# Altium schematic sheet Power.SchDoc: POWER
size A4; ApprovedBy: ANBI; CheckedBy: ANBI; Author: SEOKIPO; CompanyName: SY 동아퓨얼셀; DrawnBy: SEOKIPO; Engineer: SEOKIPO; Revision: 001; SheetNumber: 6; SheetTotal: 6
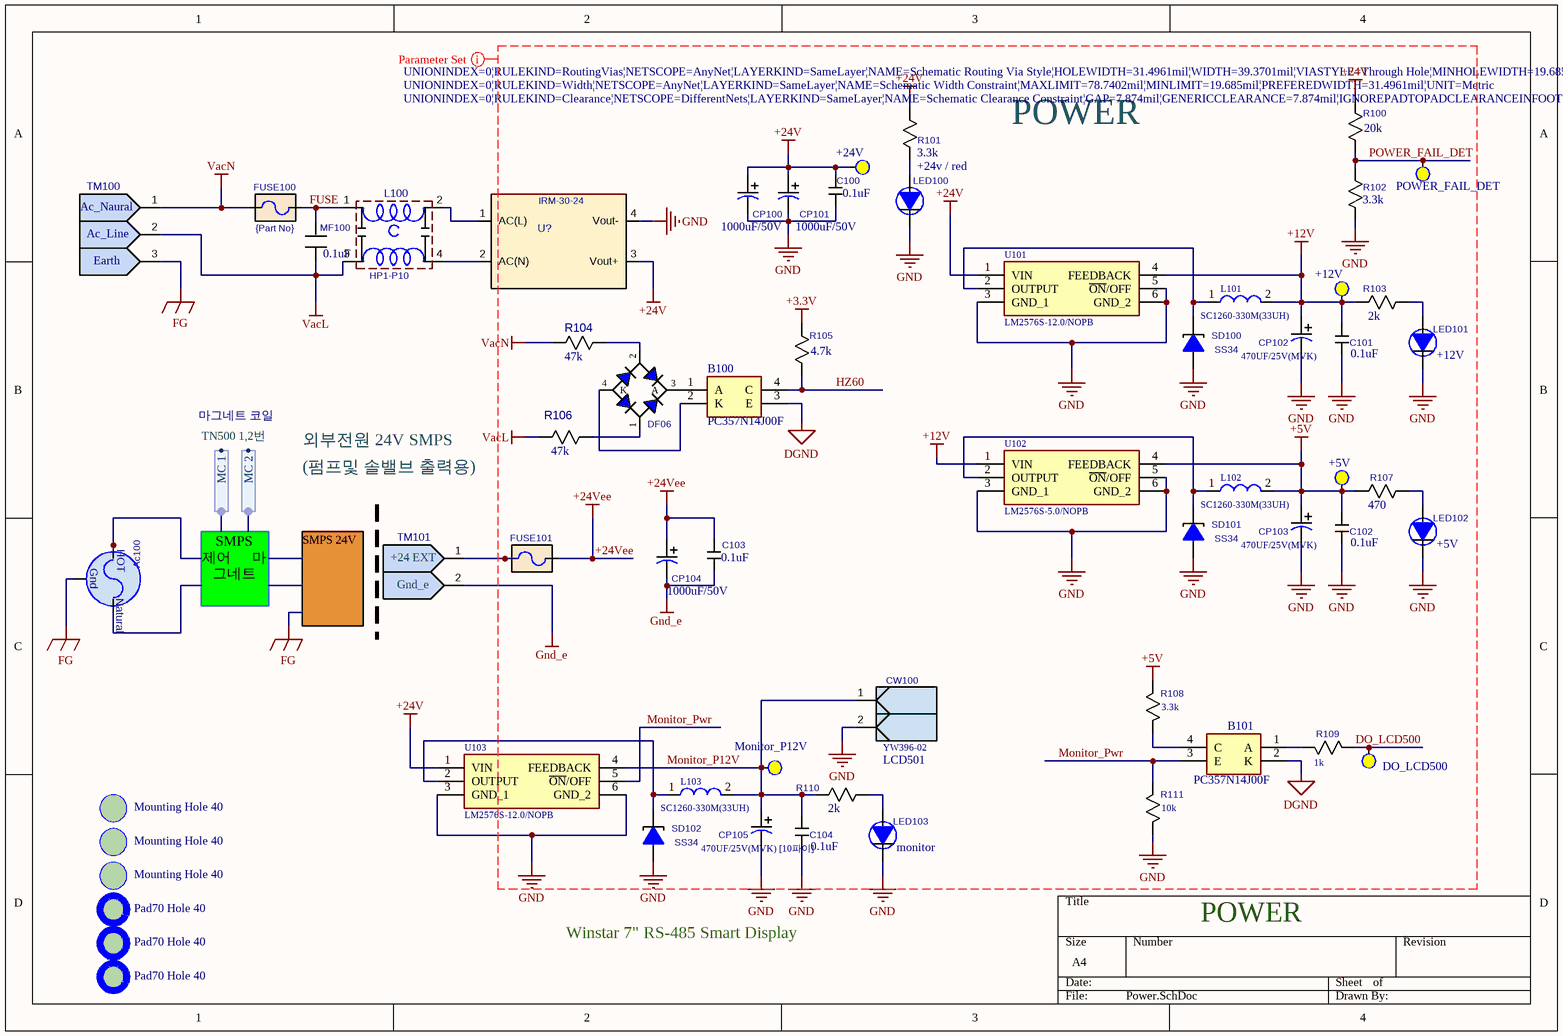
[diagram p0: Power.SchDoc]

## Parts
+5V  Test Point_top  [TP_KEYSTONE_5000]  (value not drawn)
+12V  Test Point_top  [TP_KEYSTONE_5000]  (value not drawn)
+24V  Test Point_top  [TP_KEYSTONE_5000]  (value not drawn)
Ac100  ac2  (value not drawn)
B100  PC357N14J00F  [SOP254P675X300-4N]
B101  PC357N14J00F  [SOP254P675X300-4N]
BD100  Part No.: DF06  [DF-S]  (hidden comment: DF06S)
C100  규격: 0.1uF  [CC2012]  (hidden comment: CS2012)
C101  규격: 0.1uF  [CC2012]  (hidden comment: CS2012)
C102  규격: 0.1uF  [CC2012]  (hidden comment: CS2012)
C103  규격: 0.1uF  [CC2012]  (hidden comment: CS2012)
C104  규격: 0.1uF  [CC2012]  (hidden comment: CS2012)
CP100  규격: 1000uF/50V  [CP5_12]  (hidden comment: CP5_12)
CP101  규격: 1000uF/50V  [CP5_12]  (hidden comment: CP5_12)
CP102  규격: 470UF/25V(MVK)  [CP10_SMT]  (hidden comment: CP10_SMT)
CP103  규격: 470UF/25V(MVK)  [CP10_SMT]  (hidden comment: CP10_SMT)
CP104  규격: 1000uF/50V  [CP5_12]  (hidden comment: CP5_12)
CP105  규격: 470UF/25V(MVK) [10파이]  [CP10_SMT]  (hidden comment: CP10_SMT)
CW100  BOP No.: LCD501  [YW396_02]  (hidden comment: YW396-02)
DO_LCD500  Test Point_top  [TP_KEYSTONE_5000]  (value not drawn)
FUSE100  Part No.: {Part No}  [FUSE_HOLD_S]  (hidden comment: FUSE_CASE)
FUSE101  FUSE_CASE  [FUSE_HOLD_S]  (value not drawn)
Hole100  Mounting Hole 40  [HOLE40]
Hole101  Mounting Hole 40  [HOLE40]
Hole103  Mounting Hole 40  [HOLE40]
Hole104  Pad70 Hole 40  [pad70h45]
Hole105  Pad70 Hole 40  [pad70h45]
Hole?  Pad70 Hole 40  [pad70h45]
L100  Part No.: HP1-P10  [NF_HP1]  (hidden comment: NF_HP1)
L101  Part No.: SC1260-330M(33UH)  [SC1260S]  (hidden comment: SC1260)
L102  Part No.: SC1260-330M(33UH)  [SC1260S]  (hidden comment: SC1260)
L103  Part No.: SC1260-330M(33UH)  [SC1260S]  (hidden comment: SC1260)
LED100  Name: +24v / red  [LED1608]  (hidden comment: LED1608)
LED101  Name: +12V  [LED1608]  (hidden comment: LED1608)
LED102  Name: +5V  [LED1608]  (hidden comment: LED1608)
LED103  Name: monitor  [LED1608]  (hidden comment: LED1608)
MF100  규격: 0.1uF  [MF_104_Filkor]  (hidden comment: MF104_FLIKO)
Monitor_P12V  Test Point_top  [TP_KEYSTONE_5000]  (value not drawn)
POWER_FAIL_DET  Test Point_top  [TP_KEYSTONE_5000]  (value not drawn)
R100  규격: 20k  [RESC1608X55N]  (hidden comment: R1608)
R101  규격: 3.3k  [RESC1608X55N]  (hidden comment: R1608)
R102  규격: 3.3k  [RESC1608X55N]  (hidden comment: R1608)
R103  규격: 2k  [RESC1608X55N]  (hidden comment: R1608)
R104  규격: 47k  [R3216]  (hidden comment: R3216)
R105  규격: 4.7k  [RESC1608X55N]  (hidden comment: R1608)
R106  규격: 47k  [R3216]  (hidden comment: R3216)
R107  규격: 470  [RESC1608X55N]  (hidden comment: R1608)
R108  규격: 3.3k  [RESC1608X55N]  (hidden comment: R1608)
R109  규격: 1k  [RESC1608X55N]  (hidden comment: R1608)
R110  규격: 2k  [RESC1608X55N]  (hidden comment: R1608)
R111  규격: 10k  [RESC1608X55N]  (hidden comment: R1608)
SD100  Part No.: SS34  [D5025]  (hidden comment: SK_SMT)
SD101  Part No.: SS34  [D5025]  (hidden comment: SK_SMT)
SD102  Part No.: SS34  [D5025]  (hidden comment: SK_SMT)
TM100  TERMINAL-2PIN  [TERMINAL_10_3]  (value not drawn)
TM101  TERMINAL-2PIN  [TERMINAL_10_2]  (value not drawn)
U101  Part No.: LM2576S-12.0/NOPB  [KTT0005B]  (hidden comment: LM2576S-5.0_NOPB)
U102  Part No.: LM2576S-5.0/NOPB  [KTT0005B]  (hidden comment: LM2576S-5.0_NOPB)
U103  Part No.: LM2576S-12.0/NOPB  [KTT0005B]  (hidden comment: SC1260-330M(33UH))
U?  AC2DC 24V_1200mA  (value not drawn)

## Harnesses
마그네트 코일: MC 1
?: MC 2

## Nets
+3.3V: R105.1
+5V: +5V.1(tp) C102.2 CP103.2 L102.2 R107.1 R108.2 U102.4(FEEDBACK)
+12V: +12V.1(tp) C101.2 CP102.2 L101.2 R103.1 U101.4(FEEDBACK) U102.1(VIN)
+24V: +24V.1(tp) C100.2 CP100.2 CP101.2 R100.1 R101.1 U101.1(VIN) U103.1(VIN) U?.3(Vout+)
+24Vee: C103.2 CP104.2 FUSE101.2
DGND: B100.3(E) B101.2(K)
FG: Ac100.3(GND) TM100.3
GND: C100.1 C101.1 C102.1 C104.1 CP100.1 CP101.1 CP102.1 CP103.1 CP105.1 CW100.2 LED100.2 LED101.2 LED102.2 LED103.2 R102.2 R111.2 SD100.1 SD101.1 SD102.1 U101.3(GND_1) U101.5(~{ON}/OFF) U101.6(GND_2) U102.3(GND_1) U102.5(~{ON}/OFF) U102.6(GND_2) U103.3(GND_1) U103.6(GND_2) U?.4(Vout-)
Gnd_e: C103.1 CP104.1 TM101.2
VacL: L100.3 MF100.2 R106.1 TM100.2
VacN: FUSE100.1 R104.1 TM100.1
DO_LCD500: DO_LCD500.1(tp) R109.1
FUSE: FUSE100.2 L100.1 MF100.1
HZ60: B100.4(C) R105.2
Monitor_P12V: C104.2 CP105.2 CW100.1 L103.2 Monitor_P12V.1(tp) R110.1 U103.4(FEEDBACK)
Monitor_Pwr: B101.3(E) R111.1 U103.5(~{ON}/OFF)
POWER_FAIL_DET: POWER_FAIL_DET.1(tp) R100.2 R102.1
NetB100_1: B100.1(A) BD100.3(A)
NetB100_2: B100.2(K) BD100.4(K)
NetB101_1: B101.1(A) R109.2
NetB101_4: B101.4(C) R108.1
NetBD100_1: BD100.1(C) R106.2
NetBD100_2: BD100.2(C) R104.2
NetFUSE101_1: FUSE101.1 TM101.1
NetL100_2: L100.2 U?.1(AC(L))
NetL100_4: L100.4 U?.2(AC(N))
NetL101_1: L101.1 SD100.2 U101.2(OUTPUT)
NetL102_1: L102.1 SD101.2 U102.2(OUTPUT)
NetL103_1: L103.1 SD102.2 U103.2(OUTPUT)
NetLED100_1: LED100.1 R101.2
NetLED101_1: LED101.1 R103.2
NetLED102_1: LED102.1 R107.2
NetLED103_1: LED103.1 R110.2

Not connected (* = marked no-connect by the designer): Ac100 1 2; Hole100 1; Hole101 1; Hole103 1; Hole104 1; Hole105 1; Hole? 1

## Layout directives
rule Clearance Constraint [Clearance = 0.2mm]; rule Width Constraint [Pref Width = 0.8mm    Min Width = 0.5mm    Max Width = 2mm]; rule Routing Via Style [Pref Size = 1mm    Pref Hole Size = 0.8mm]: +3.3V, +5V, +12V, +24V, +24Vee, DGND, DO_LCD500, GND, Gnd_e, HZ60, Monitor_P12V, Monitor_Pwr, POWER_FAIL_DET, VacL, VacN

## Notes on the sheet
- POWER
- (near TM100) Ac_Naural
- (near TM100) Ac_Line
- (near TM100) Earth
- TN500 1,2번
- 외부전원 24V SMPS
- (펌프및 솔밸브 출력용)
- (near TM101) +24 EXT
- SMPS        제어      마그네트
- SMPS 24V
- (near TM101) Gnd_e
- Winstar 7" RS-485 Smart Display
- (in symbol AC_gnd) HOT; Gnd; Natural

## Library data of the parts
+5V +12V +24V DO_LCD500 Monitor_P12V POWER_FAIL_DET = Tp_5000: Pad30; Part No.: *
Ac100 = AC_gnd: Part No.: *
B100 B101 = PC357N14J00F: Integrated Circuit; Part No.: PC357N14J00F; Price: 81; Height: 3mm
BD100 = DF06S: Full Wave Diode Bridge; ComponentField6: Published 8-Jun-2000; OriginalName: BRIDGE; Price: 60
C100-C104 = CS2012: Part No.: C2012X7R1H104KT  (CC20X104K50W); Price: 6
CP100 CP101 CP104 = CP5_12: Part No.: {Part No}; Price: 205
CP102 CP103 CP105 = CP10_SMT: Part No.: CHIP 전해 470UF/25V(MVK) [10파이]; Price: 130
FUSE101 = FUSE_CASE: Part No.: 4527; Price: 1000
Hole100 Hole101 Hole103 = HOLE40: Part No.: *
Hole104 Hole105 Hole? = PAD70h45: Part No.: *
L101 L102 = SC1260: Inductor; Manufacturer_Name: TDK; Manufacturer_Part_Number: VLP8040T-100M; Mouser Part Number: 810-VLP8040T-100M; Mouser Price/Stock: https://www.mouser.co.uk/ProductDetail/TDK/VLP8040T-100M?qs=uxmvvYJjMIsKO4pNbUQWxA%3D%3D; Arrow Price/Stock: https://www.arrow.com/en/products/vlp8040t-100m/tdk; Datasheet Link: https://componentsearchengine.com/Datasheets/2/VLP8040T-100M.pdf; Height: 4mm; Price: 240
L103 = SC1260: Inductor; Manufacturer_Part_Number: VLP8040T-100M; Height: 4mm; Price: 240
LED100 LED102 = LED1608: Part No.: BL-HUF35A-AV-TRB; Price: {Price}
LED101 LED103 = LED1608: Part No.: {Part No}; Price: {Price}
MF100 = MF104_FLIKO: Part No.: {Part No}; Price: {Price}
R100 R109 R111 = R1608: Part No.: {Part No}; Price: {Price}
R101 R102 R108 = R1608: Part No.: WR06X332JT(3.3KR)J; Price: 1.0
R103 R110 = R1608: Part No.: WR06X202JT(2KR)J; Price: 1
R104 R106 = R3216: Part No.: WR12X473JT(47KR)J; Price: 1
R105 = R1608: Part No.: WR06X472JT(4.7KR)J; Price: 1
R107 = R1608: Part No.: WR06X471JT(470R)J; Price: 1.0
SD100-SD102 = SK_SMT: 규격: 3A; Price: 46
TM100 = TERMINAL-3P: Part No.: HP-1000SA-3pin; Price: 390
TM101 = TERMINAL-2P: Part No.: HP-1000SA-2pin; Price: 260
U101-U103 = LM2576S-5.0_NOPB: Integrated Circuit; Price: 485
  U101 U103: Arrow Part Number: LM2576S-12.0/NOPB
  U102: Arrow Part Number: LM2576S-5.0/NOPB
U? = IRM-30-24: {Price}: Price; Part No.: IRM-30-24
CW100 = YW396-02: Price: 20; Part No.: YW396-02
FUSE100 = FUSE_CASE: Price: {Price}
L100 = NF_HP1: Price: {Price}